# Altium schematic sheet variantes.SchDoc
size A
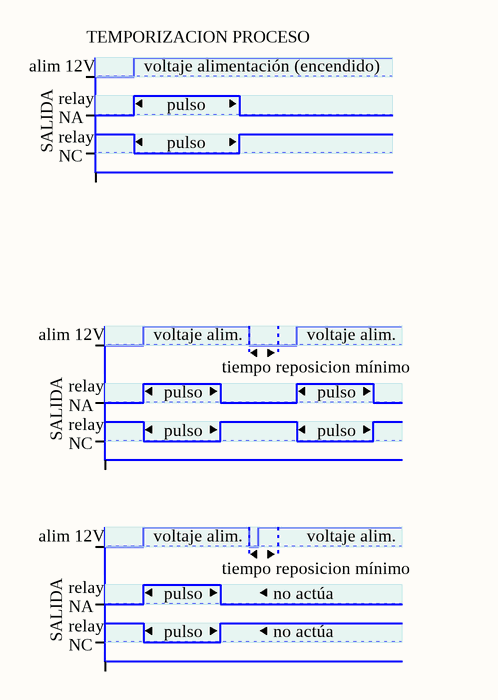
[diagram p0: variantes.SchDoc]

## Notes on the sheet
- alim 12V
- TEMPORIZACION PROCESO
- voltaje alimentación (encendido)
- relay
  NA
- relay
  NC
- SALIDA
- pulso
- voltaje alim.
- tiempo reposicion mínimo
- no actúa